# Altium schematic sheet ANALOGv1.4.SchDoc
size A4
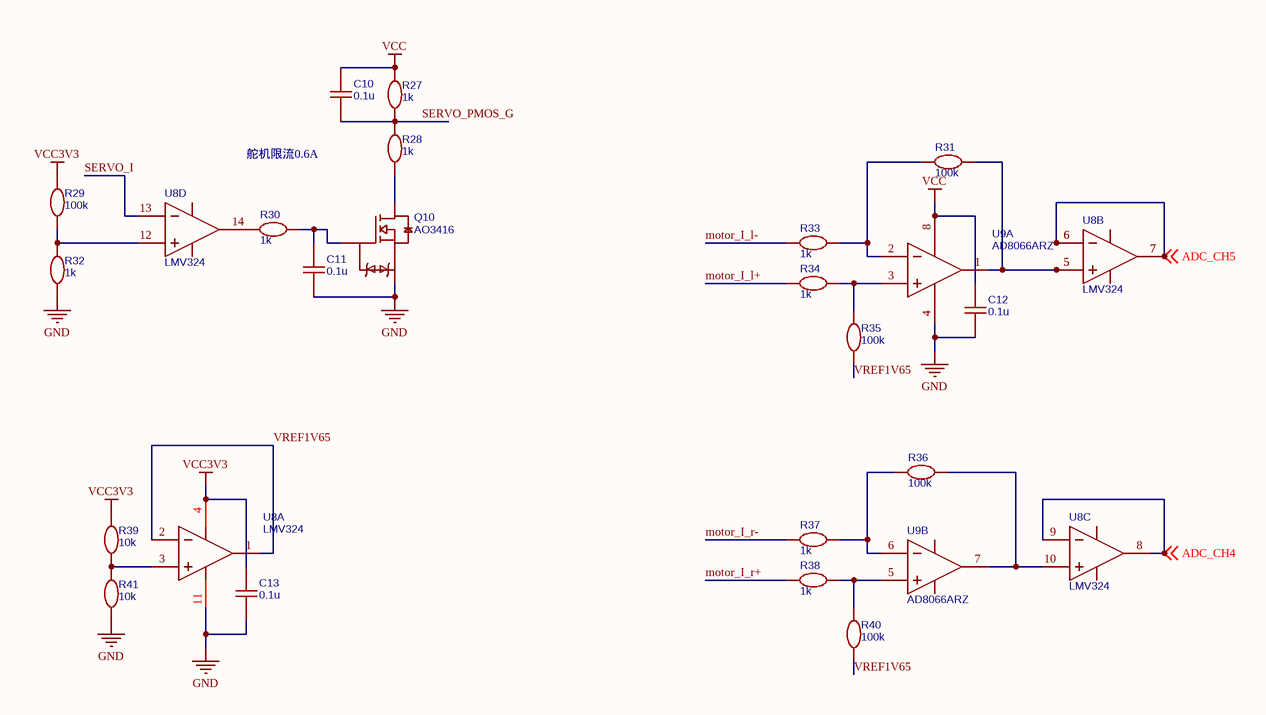
[diagram p0: ANALOGv1.4.SchDoc]

## Parts
C10  0.1u  [C0603]
C11  0.1u  [C0603]
C12  0.1u  [C0603]
C13  0.1u  [C0603]
Q10  AO3416  [SOT-23-3_L2.9-W1.6-P1.90-LS2.8-BR]
R27  1k  [R0603]
R28  1k  [R0603]
R29  100k  [R0603]
R30  1k  [R0603]
R31  100k  [R0603]
R32  1k  [R0603]
R33  1k  [R0603]
R34  1k  [R0603]
R35  100k  [R0603]
R36  100k  [R0603]
R37  1k  [R0603]
R38  1k  [R0603]
R39  10k  [R0603]
R40  100k  [R0603]
R41  10k  [R0603]
U8  LMV324  [SOP-14_L8.6-W3.9-P1.27-LS6.0-BL]  (parts A,B,C,D of 4)
U9  AD8066ARZ  [SOIC-8_L5.0-W4.0-P1.27-LS6.0-BL]  (parts A,B of 2)

## Nets
GND: C11.1 C12.1 C13.1 Q10.2(S) R32.1 R41.1 U8.11(GND) U9.4(-VS)
VCC: C10.2 C12.2 R27.2 U9.8(+VS)
VCC3V3: C13.2 R29.2 R39.2 U8.4(VCC)
ADC_CH4: U8.8(3OUT) U8.9(3IN-) ; off-sheet ADC_CH4
ADC_CH5: U8.6(2IN-) U8.7(2OUT) ; off-sheet ADC_CH5
motor_I_l+: R34.1
motor_I_l-: R33.1
motor_I_r+: R38.1
motor_I_r-: R37.1
SERVO_I: U8.13(4IN-)
SERVO_PMOS_G: C10.1 R27.1 R28.2
VREF1V65: R35.1 R40.1 U8.1(1OUT) U8.2(1IN-)
NetC11_2: C11.2 Q10.1(G) R30.2
NetQ10_3: Q10.3(D) R28.1
NetR29_1: R29.1 R32.2 U8.12(4IN+)
NetR30_1: R30.1 U8.14(4OUT)
NetR31_1: R31.1 R33.2 U9.2(-IN_1)
NetR31_2: R31.2 U8.5(2IN+) U9.1(VOUT_1)
NetR34_2: R34.2 R35.2 U9.3(+IN_1)
NetR36_1: R36.1 U8.10(3IN+) U9.7(VOUT_2)
NetR36_2: R36.2 R37.2 U9.6(-IN_2)
NetR38_2: R38.2 R40.2 U9.5(+IN_2)
NetR39_1: R39.1 R41.2 U8.3(1IN+)

## Notes on the sheet
- 舵机限流0.6A

## Library data of the parts
C10-C13 = C0603: nameAlias: Value(F); Contributor: LCEDA_Lib; spicePre: C; spiceSymbolName: C_0603_US
Q10 = AO3416: BOM_Manufacturer: AOS; SMT Type: Extend; BOM_Supplier: LCSC; BOM_Manufacturer Part: AO3416; BOM_Supplier Part: C43307; BOM_LCSC Assembly: Yes; spicePre: Q; spiceSymbolName: AO3416
R27-R41 = R0603: nameAlias: Value(Ω); Contributor: LCEDA_Lib; spicePre: R; spiceSymbolName: R_0603_EU
U8 = LMV324: BOM_Manufacturer: IDCHIP; subpart_no: 1; BOM_Supplier: LCSC; BOM_Supplier Part: C395458; BOM_Manufacturer Part: LMV324; spicePre: U; spiceSymbolName: LMV324
U9 = AD8066ARZ: BOM_Manufacturer: ADI; subpart_no: 1; tags: FET Operational Amplifier; BOM_Supplier Part: C9647; BOM_Supplier: LCSC; BOM_Manufacturer Part: AD8066ARZ; image: http://image.lceda.cn/szlcsc/C9647.jpg; spicePre: U; spiceSymbolName: AD8066ARZ